# Altium schematic sheet WireTest.SchDoc
size D
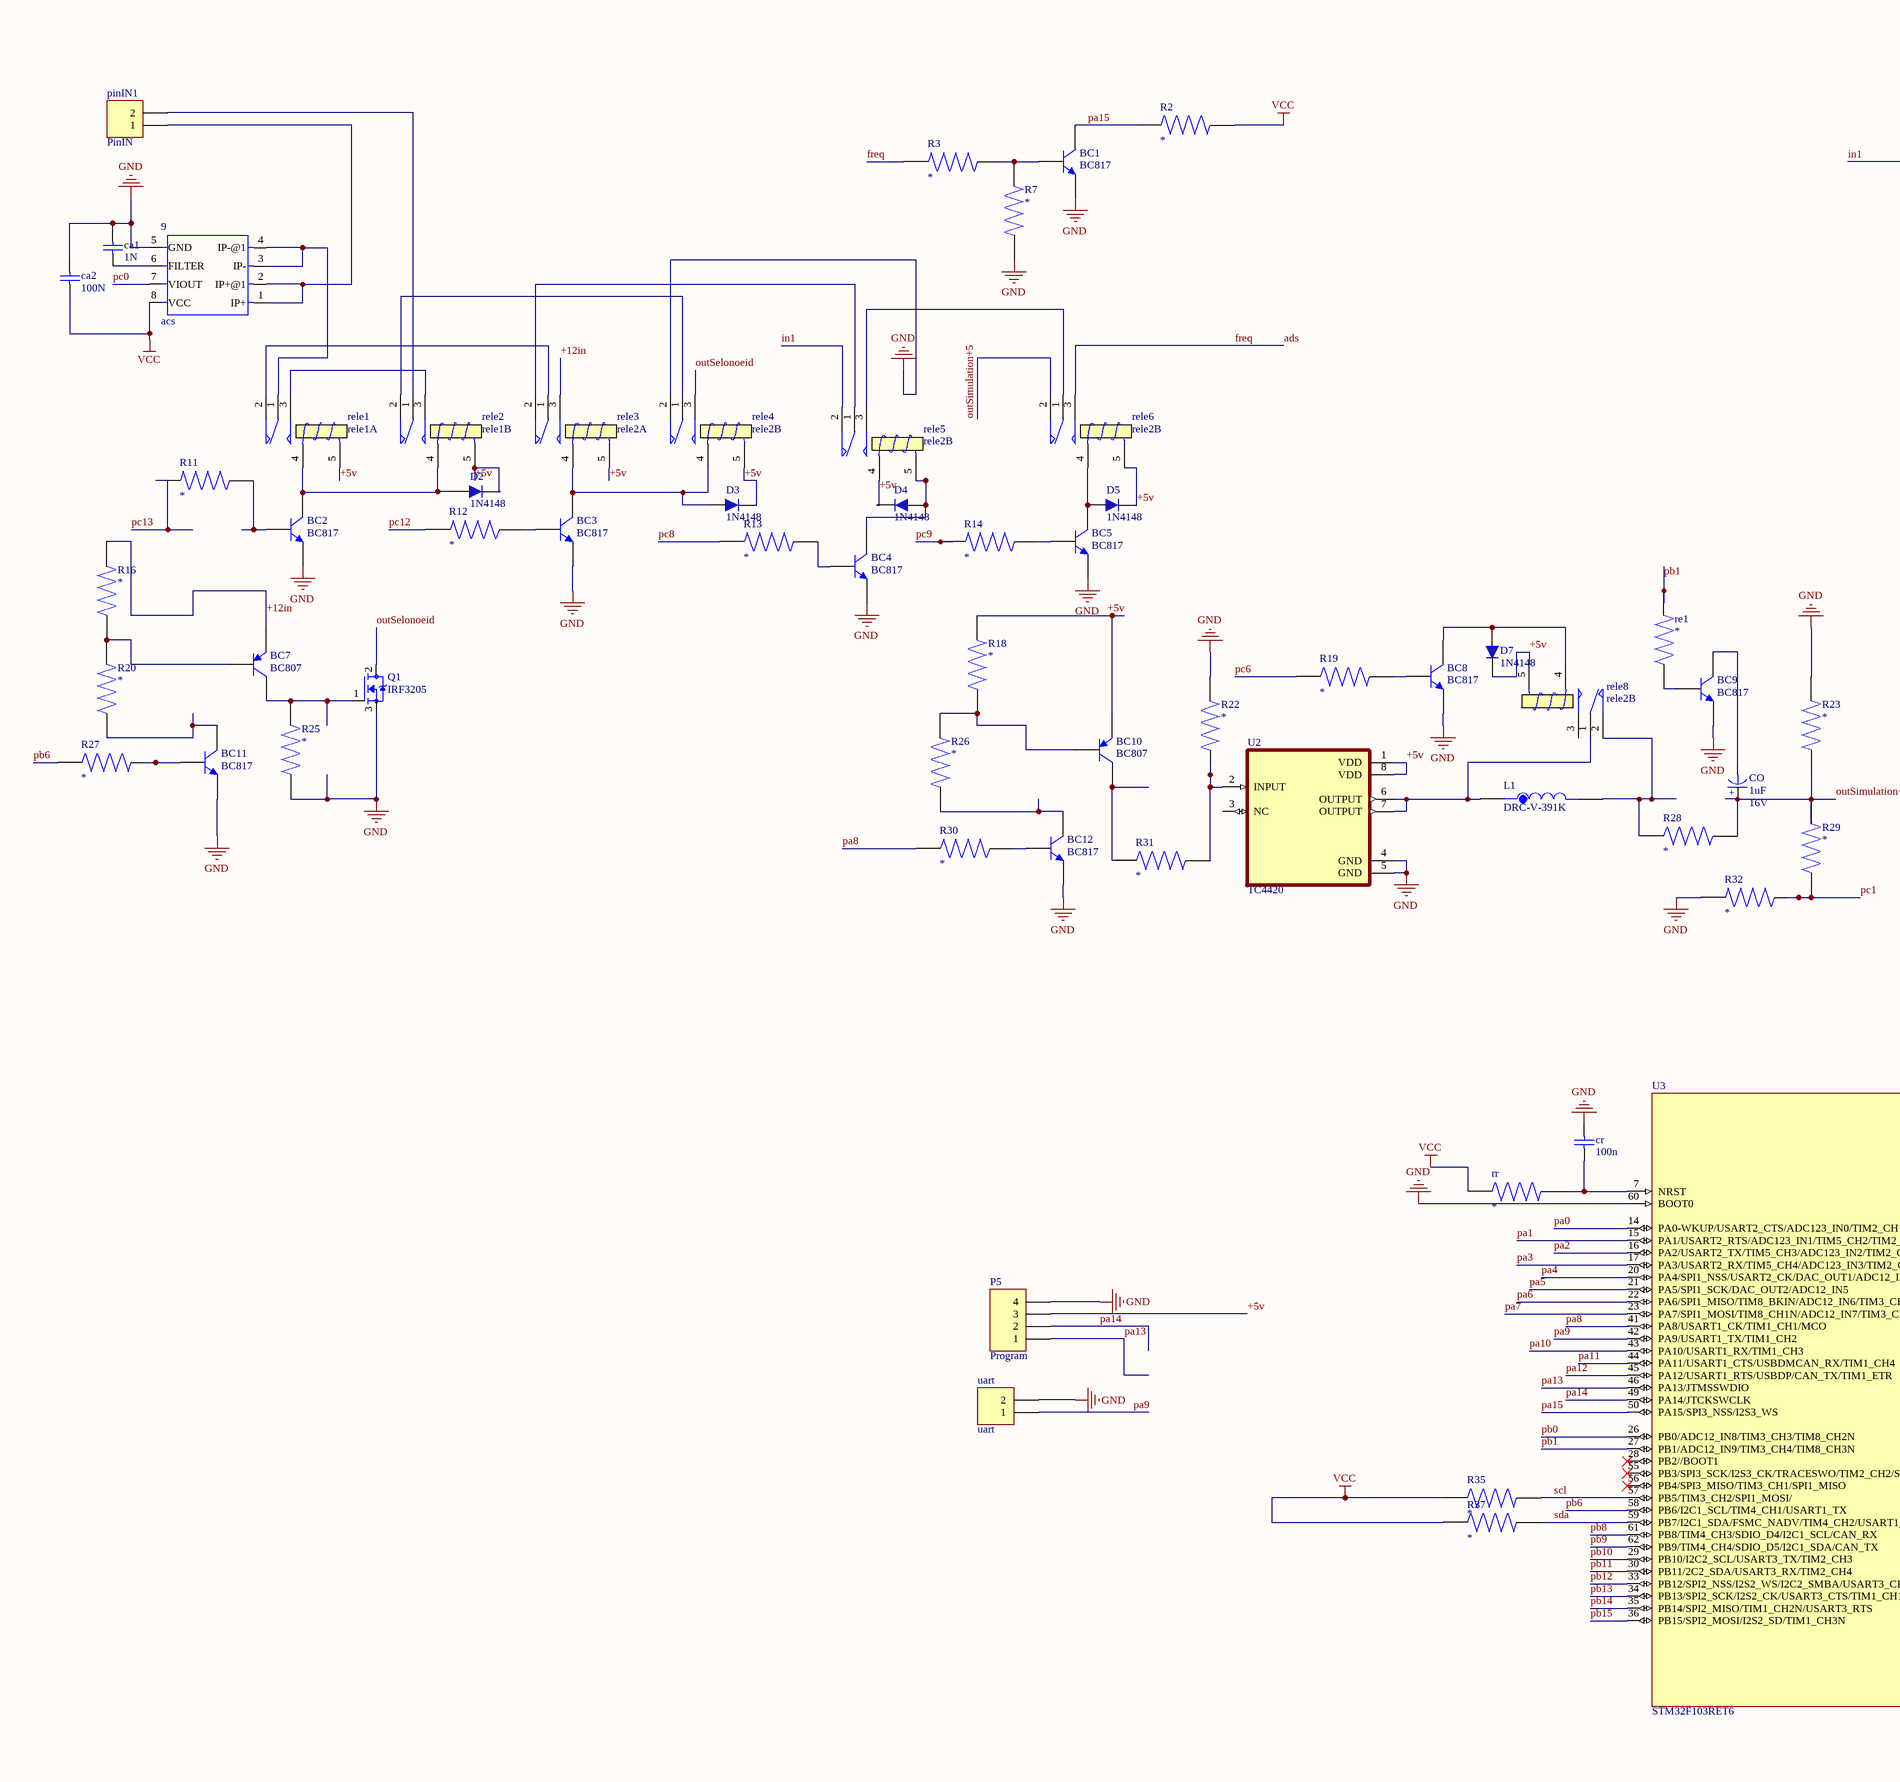
[diagram p0: WireTest.SchDoc, left]
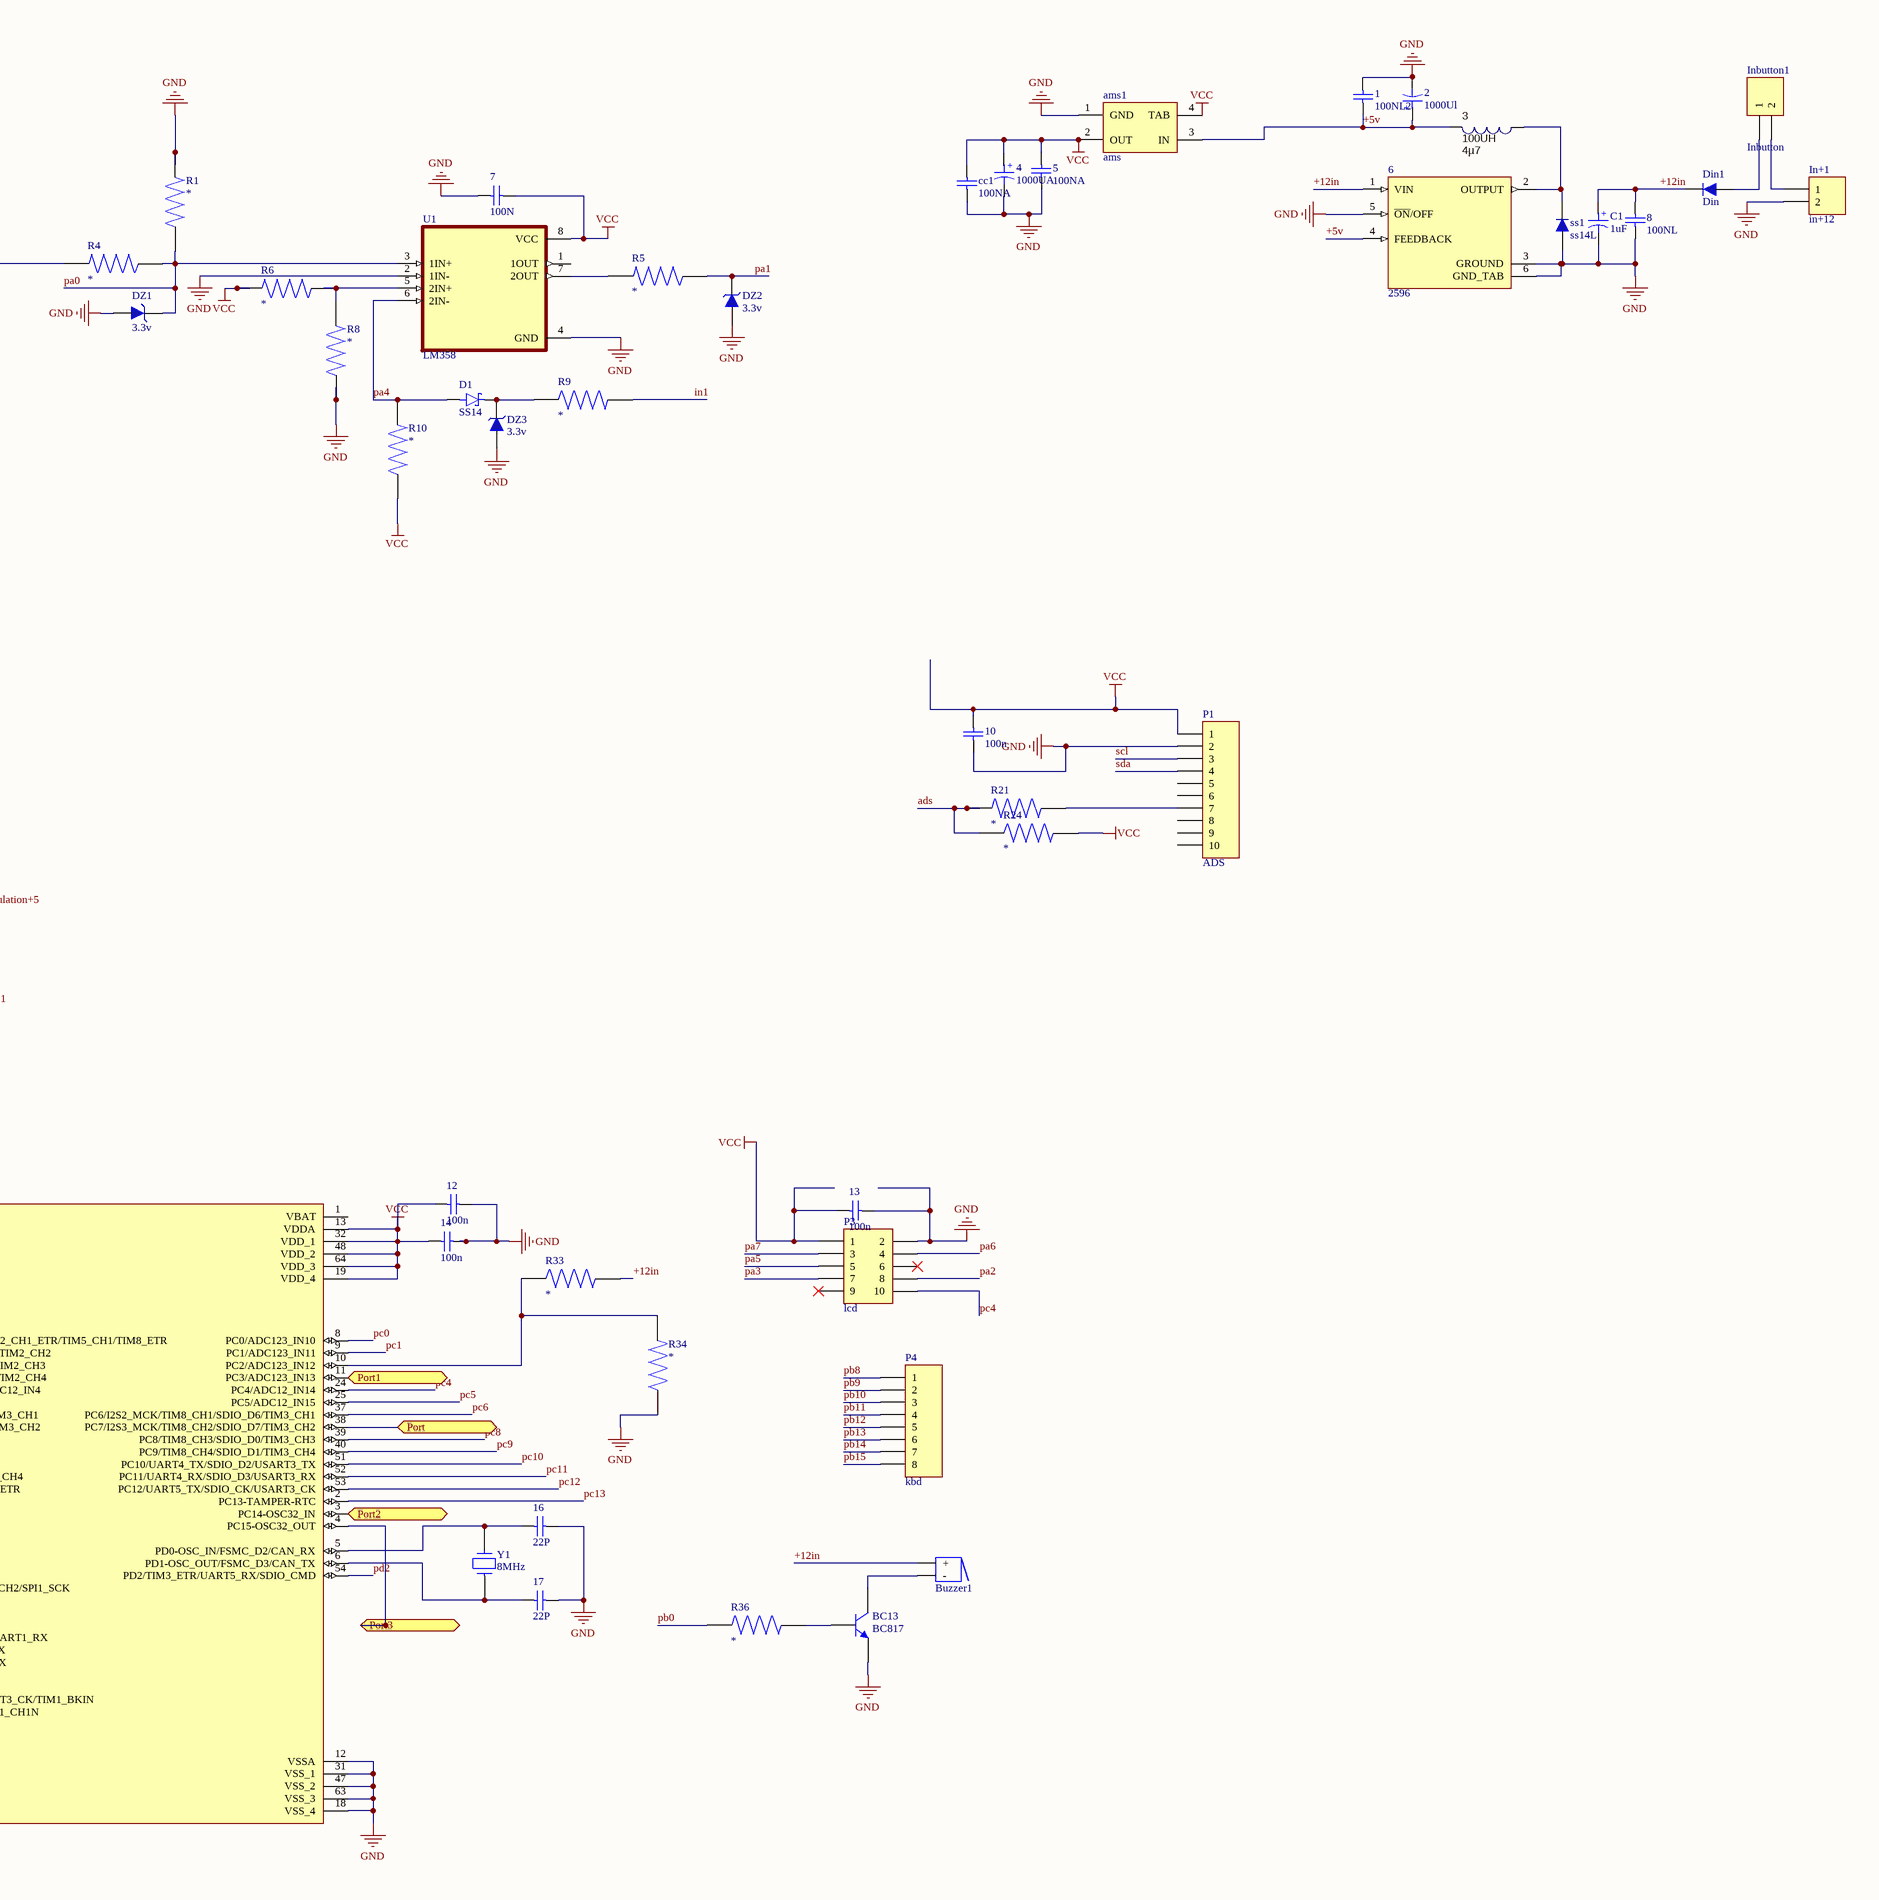
[diagram p1: WireTest.SchDoc, right]

## Parts
1  100NL2  [CAPC3413X12N]
2  1000Ul  [Cap electrolitic radial 8x12-3.5]
3  100UH  value 4µ7  [Inductor SMD 3x3.2mm]
4  1000UA  [Cap electrolitic radial 8x12-3.5]
5  100NA  [CAPC3413X12N]
6  2596  [TO170P1524X483-6N]
7  100N  [CAPC3413X12N]
8  100NL  [CAPC3413X12N]
9  acs  [SOIC8-1.27-5X4MM]
10  100n  [CAPC3413X12N]
12  100n  [CAPC3413X12N]
13  100n  [CAPC3413X12N]
14  100n  [CAPC3413X12N]
16  22P  [CAPC3413X12N]
17  22P  [CAPC3413X12N]
ams1  ams  [MP04A_N]
BC1  BC817  [SOT23_N]
BC2  BC817  [SOT23_N]
BC3  BC817  [SOT23_N]
BC4  BC817  [SOT23_N]
BC5  BC817  [SOT23_N]
BC7  BC807  [SOT23_BEC_N]
BC8  BC817  [SOT23_N]
BC9  BC817  [SOT23_N]
BC10  BC807  [SOT23_BEC_N]
BC11  BC817  [SOT23_N]
BC12  BC817  [SOT23_N]
BC13  BC817  [SOT23_N]
Buzzer1  Buzzer  [BUZZER]  (value not drawn)
C1  1uF  [Cap electrolitic radial 8x12-3.5]
ca1  1N  [CAPC3413X12N]
ca2  100N  [CAPC3413X12N]
cc1  100NA  [CAPC3413X12N]
CO  value 1uF  Voltage: 16V  [cap 01]  (hidden comment: 400U)
cr  100n  [CAPC3413X12N]
D1  SS14  [DIOM4325X250N]
D2  1N4148  [Diode 1n4148 SMD]
D3  1N4148  [Diode 1n4148 SMD]
D4  1N4148  [Diode 1n4148 SMD]
D5  1N4148  [Diode 1n4148 SMD]
D7  1N4148  [Diode 1n4148 SMD]
Din1  Din  [Diode 1W Stand]
DZ1  3.3v  [SOD80, LL-34]
DZ2  3.3v  [SOD80, LL-34]
DZ3  3.3v  [SOD80, LL-34]
In+1  in+12  [HDR1X2]
Inbutton1  Inbutton  [HDR1X2]
L1  DRC-V-391K  [IND_DRC-V-391K]
P1  ADS  [HDR1X10]
P3  lcd  [HDR2X5]
P4  kbd  [HDR1X8]
P5  Program  [HDR1X4]
pinIN1  PinIN  [HDR1X2]
Q1  IRF3205  [TO254P1067X483X3124-3P]
R1  4.7k  [RESC2012X65N]  (value not drawn)
R2  10k  [RESC2012X65N]  (value not drawn)
R3  4.7k  [RESC2012X65N]  (value not drawn)
R4  47k  [RESC2012X65N]  (value not drawn)
R5  1k  [RESC2012X65N]  (value not drawn)
R6  4.7k  [RESC2012X65N]  (value not drawn)
R7  10k  [RESC2012X65N]  (value not drawn)
R8  2.2k  [RESC2012X65N]  (value not drawn)
R9  4.7k  [RESC2012X65N]  (value not drawn)
R10  10k  [RESC2012X65N]  (value not drawn)
R11  1k  [RESC2012X65N]  (value not drawn)
R12  1k  [RESC2012X65N]  (value not drawn)
R13  1k  [RESC2012X65N]  (value not drawn)
R14  1k  [RESC2012X65N]  (value not drawn)
R16  10k  [RESC2012X65N]  (value not drawn)
R18  4.7k  [RESC2012X65N]  (value not drawn)
R19  1k  [RESC2012X65N]  (value not drawn)
R20  4.7k  [RESC2012X65N]  (value not drawn)
R21  10k  [RESC2012X65N]  (value not drawn)
R22  2.2k  [RESC2012X65N]  (value not drawn)
R23  adj  [RESC2012X65N]  (value not drawn)
R24  10k  [RESC2012X65N]  (value not drawn)
R25  10k  [RESC2012X65N]  (value not drawn)
R26  1k  [RESC2012X65N]  (value not drawn)
R27  4.7k  [RESC2012X65N]  (value not drawn)
R28  20r  [RESC2012X65N]  (value not drawn)
R29  10k  [RESC2012X65N]  (value not drawn)
R30  330r  [RESC2012X65N]  (value not drawn)
R31  20r  [RESC2012X65N]  (value not drawn)
R32  4.7k  [RESC2012X65N]  (value not drawn)
R33  10k  [RESC2012X65N]  (value not drawn)
R34  1k  [RESC2012X65N]  (value not drawn)
R35  4k7  [RESC2012X65N]  (value not drawn)
R36  1k  [RESC2012X65N]  (value not drawn)
R37  4k7  [RESC2012X65N]  (value not drawn)
re1  1k  [RESC2012X65N]  (value not drawn)
rele1  rele1A  [Relay 15.40x12.10x13.10]
rele2  rele1B  [Relay 15.40x12.10x13.10]
rele3  rele2A  [Relay 15.40x12.10x13.10]
rele4  rele2B  [Relay 15.40x12.10x13.10]
rele5  rele2B  [Relay 15.40x12.10x13.10]
rele6  rele2B  [Relay 15.40x12.10x13.10]
rele8  rele2B  [Relay 15.40x12.10x13.10]
rr  1k  [RESC2012X65N]  (value not drawn)
ss1  ss14L  [Diode 1N4007 SMD]
U1  LM358  [SOIC127P599X175-8N]
U2  TC4420  [DIP787W46P254L927H533Q8]
U3  STM32F103RET6  [QFP50P1200X1200X160-64N]
uart  uart  [HDR1X2]
Y1  8MHz  [My_Crystal]

## Ports
Port, Port1, Port2, Port3

## Nets
GND: 1.2 2.2 4.2 5.1 6.3(GROUND) 6.5(~{ON}/OFF) 6.6(GND_TAB) 7.2 8.1 9.5(GND) 10.2 12.2 13.2 14.2 16.1 17.1 ams1.1(GND) BC1.2(E) BC2.2(E) BC3.2(E) BC4.2(E) BC5.2(E) BC8.2(E) BC9.2(E) BC11.2(E) BC12.2(E) BC13.2(E) C1.2 ca1.1 ca2.1 cc1.1 cr.2 DZ1.1 DZ2.1 DZ3.1 In+1.2 P1.2 P3.2 P5.4 Q1.3(S) R1.1 R7.2 R8.2 R22.1 R23.2 R25.1 R32.2 R34.1 rele4.2(NC) ss1.1 U1.2(1IN-) U1.4(GND) U2.4(GND) U2.5(GND) U3.12(VSSA) U3.18(VSS_4) U3.31(VSS_1) U3.47(VSS_2) U3.60(BOOT0) U3.63(VSS_3) uart.2
VCC: 4.1 5.2 7.1 9.8(VCC) 10.1 12.1 13.1 14.1 ams1.2(OUT) ams1.4(TAB) ca2.2 cc1.2 P1.1 P3.1 R2.2 R6.2 R10.2 R24.2 R35.1 R37.1 rr.1 U1.8(VCC) U3.13(VDDA) U3.19(VDD_4) U3.32(VDD_1) U3.48(VDD_2) U3.64(VDD_3)
+5v: 1.1 2.1 3.2 6.4(FEEDBACK) ams1.3(IN) BC10.2(E) D2.2 D3.2 D4.2 D5.2 D7.2 P5.3 R18.1 rele1.5(T2) rele2.5(T2) rele3.5(T2) rele4.5(T2) rele5.4(T1) rele6.5(T2) rele8.5(T2) U2.1(VDD) U2.8(VDD)
+12in: 6.1(VIN) 8.2 BC7.2(E) Buzzer1.1(+) C1.1 Din1.2 R16.2 R33.2 rele3.3(NO)
ads: R3.2 R21.1 R24.1 rele6.3(NO)  [also labelled freq]
in1: R4.2 R9.2 rele5.2(NC)
outSelonoeid: Q1.2(D) rele4.3(NO)
outSimulation+5: CO.1(+) R23.1 R28.2 R29.2 rele6.2(NC)
pa0: DZ1.2 R1.2 R4.1 U1.3(1IN+) U3.14(PA0-WKUP/USART2_CTS/ADC123_IN0/TIM2_CH1_ETR/TIM5_CH1/TIM8_ETR)
pa1: DZ2.2 R5.1 U3.15(PA1/USART2_RTS/ADC123_IN1/TIM5_CH2/TIM2_CH2)
pa2: P3.8 U3.16(PA2/USART2_TX/TIM5_CH3/ADC123_IN2/TIM2_CH3)
pa3: P3.7 U3.17(PA3/USART2_RX/TIM5_CH4/ADC123_IN3/TIM2_CH4)
pa4: D1.A R10.1 U1.6(2IN-) U3.20(PA4/SPI1_NSS/USART2_CK/DAC_OUT1/ADC12_IN4)
pa5: P3.5 U3.21(PA5/SPI1_SCK/DAC_OUT2/ADC12_IN5)
pa6: P3.4 U3.22(PA6/SPI1_MISO/TIM8_BKIN/ADC12_IN6/TIM3_CH1)
pa7: P3.3 U3.23(PA7/SPI1_MOSI/TIM8_CH1N/ADC12_IN7/TIM3_CH2)
pa8: R30.2 U3.41(PA8/USART1_CK/TIM1_CH1/MCO)
pa9: U3.42(PA9/USART1_TX/TIM1_CH2) uart.1
pa10: U3.43(PA10/USART1_RX/TIM1_CH3)
pa11: U3.44(PA11/USART1_CTS/USBDMCAN_RX/TIM1_CH4)
pa12: U3.45(PA12/USART1_RTS/USBDP/CAN_TX/TIM1_ETR)
pa13: P5.1 U3.46(PA13/JTMSSWDIO)
pa14: P5.2 U3.49(PA14/JTCKSWCLK)
pa15: BC1.3(C) R2.1 U3.50(PA15/SPI3_NSS/I2S3_WS)
pb0: R36.1 U3.26(PB0/ADC12_IN8/TIM3_CH3/TIM8_CH2N)
pb1: re1.2 U3.27(PB1/ADC12_IN9/TIM3_CH4/TIM8_CH3N)
pb6: R27.1 U3.58(PB6/I2C1_SCL/TIM4_CH1/USART1_TX)
pb8: P4.1 U3.61(PB8/TIM4_CH3/SDIO_D4/I2C1_SCL/CAN_RX)
pb9: P4.2 U3.62(PB9/TIM4_CH4/SDIO_D5/I2C1_SDA/CAN_TX)
pb10: P4.3 U3.29(PB10/I2C2_SCL/USART3_TX/TIM2_CH3)
pb11: P4.4 U3.30(PB11/2C2_SDA/USART3_RX/TIM2_CH4)
pb12: P4.5 U3.33(PB12/SPI2_NSS/I2S2_WS/I2C2_SMBA/USART3_CK/TIM1_BKIN)
pb13: P4.6 U3.34(PB13/SPI2_SCK/I2S2_CK/USART3_CTS/TIM1_CH1N)
pb14: P4.7 U3.35(PB14/SPI2_MISO/TIM1_CH2N/USART3_RTS)
pb15: P4.8 U3.36(PB15/SPI2_MOSI/I2S2_SD/TIM1_CH3N)
pc0: 9.7(VIOUT) U3.8(PC0/ADC123_IN10)
pc1: R29.1 R32.1 U3.9(PC1/ADC123_IN11)
pc4: P3.10 U3.24(PC4/ADC12_IN14)
pc5: U3.25(PC5/ADC12_IN15)
pc6: R19.1 U3.37(PC6/I2S2_MCK/TIM8_CH1/SDIO_D6/TIM3_CH1)
pc8: R13.2 U3.39(PC8/TIM8_CH3/SDIO_D0/TIM3_CH3)
pc9: R14.2 U3.40(PC9/TIM8_CH4/SDIO_D1/TIM3_CH4)
pc10: U3.51(PC10/UART4_TX/SDIO_D2/USART3_TX)
pc11: U3.52(PC11/UART4_RX/SDIO_D3/USART3_RX)
pc12: R12.2 U3.53(PC12/UART5_TX/SDIO_CK/USART3_CK)
pc13: R11.2 U3.2(PC13-TAMPER-RTC)
pd2: U3.54(PD2/TIM3_ETR/UART5_RX/SDIO_CMD)
Port: U3.38(PC7/I2S3_MCK/TIM8_CH2/SDIO_D7/TIM3_CH2) ; port Port
Port1: U3.11(PC3/ADC123_IN13) ; port Port1
Port2: U3.3(PC14-OSC32_IN) ; port Port2
Port3: U3.4(PC15-OSC32_OUT) ; port Port3
scl: P1.3 R35.2 U3.57(PB5/TIM3_CH2/SPI1_MOSI/)
sda: P1.4 R37.2 U3.59(PB7/I2C1_SDA/FSMC_NADV/TIM4_CH2/USART1_RX)
Net3_1: 3.1 6.2(OUTPUT) ss1.2
Net9_1: 9.1(IP+) 9.2(IP+@1) pinIN1.1
Net9_3: 9.3(IP-) 9.4(IP-@1) rele1.1(COM)
Net9_6: 9.6(FILTER) ca1.2
Net16_2: 16.2 U3.5(PD0-OSC_IN/FSMC_D2/CAN_RX) Y1.2
Net17_2: 17.2 U3.6(PD1-OSC_OUT/FSMC_D3/CAN_TX) Y1.1
NetBC1_1: BC1.1(B) R3.1 R7.1
NetBC2_1: BC2.1(B) R11.1
NetBC2_3: BC2.3(C) D2.1 rele1.4(T1) rele2.4(T1)
NetBC3_1: BC3.1(B) R12.1
NetBC3_3: BC3.3(C) D3.1 rele3.4(T1) rele4.4(T1)
NetBC4_1: BC4.1(B) R13.1
NetBC4_3: BC4.3(C) D4.1 rele5.5(T2)
NetBC5_1: BC5.1(B) R14.1
NetBC5_3: BC5.3(C) D5.1 rele6.4(T1)
NetBC7_1: BC7.1(B) R16.1 R20.2
NetBC7_3: BC7.3(C) Q1.1(G) R25.2
NetBC8_1: BC8.1(B) R19.2
NetBC8_3: BC8.3(C) D7.1 rele8.4(T1)
NetBC9_1: BC9.1(B) re1.1
NetBC9_3: BC9.3(C) CO.2(-)
NetBC10_1: BC10.1(B) R18.2 R26.1
NetBC10_3: BC10.3(C) R31.1
NetBC11_1: BC11.1(B) R27.2
NetBC11_3: BC11.3(C) R20.1
NetBC12_1: BC12.1(B) R30.1
NetBC12_3: BC12.3(C) R26.2
NetBC13_1: BC13.1(B) R36.2
NetBC13_3: BC13.3(C) Buzzer1.2(-)
Netcr_1: cr.1 rr.2 U3.7(NRST)
NetD1_C: D1.C(K) DZ3.2 R9.1
NetDin1_1: Din1.1 Inbutton1.1
NetIn+1_1: In+1.1 Inbutton1.2
NetL1_1: L1.1 rele8.1(COM) U2.6(OUTPUT) U2.7(OUTPUT)
NetL1_2: L1.2 R28.1 rele8.2(NC)
NetP1_7: P1.7 R21.2
NetpinIN1_2: pinIN1.2 rele2.1(COM)
NetR5_2: R5.2 U1.7(2OUT)
NetR6_1: R6.1 R8.1 U1.5(2IN+)
NetR22_2: R22.2 R31.2 U2.2(INPUT)
NetR33_1: R33.1 R34.2 U3.10(PC2/ADC123_IN12)
Netrele1_2: rele1.2(NC) rele3.1(COM)
Netrele1_3: rele1.3(NO) rele2.3(NO)
Netrele2_2: rele2.2(NC) rele4.1(COM)
Netrele3_2: rele3.2(NC) rele5.1(COM)
Netrele5_3: rele5.3(NO) rele6.1(COM)

Not connected (* = marked no-connect by the designer): P1 5 6 8 9 10; P3 6* 9*; rele8 3(NO); U1 1(1OUT); U2 3(NC); U3 1(VBAT) 28(PB2//BOOT1)* 55(PB3/SPI3_SCK/I2S3_CK/TRACESWO/TIM2_CH2/SPI1_SCK)* 56(PB4/SPI3_MISO/TIM3_CH1/SPI1_MISO)*

## Notes on the sheet
- (in symbol Cap ELECTROLITIC TOTAL SIZE) +

## Library data of the parts
1 5 7 8 10 12-14 16 17 ca1 ca2 cc1 cr = CAP SMD 0805: CAP 0805; Designer: Abbas Basereh; Desc.: CAP SMD 0805; Data: 16-12-2016
2 4 = Cap ELECTROLITIC TOTAL SIZE: Cap electrolitic radial; Designer: Abbas Basereh; VALUE: 1uF; Data: 16-12-2016; Part. No: *
3 = Inductor 4.7µH SMD 3x3.2mm: Tolerance: ±20%; SCDType: source; Package / Case: Inductor 4.7µH SMD 3x3.2mm; Type: Ferrite Core; Supplier 1: Digi-Key; Operating Temperature: -40°C ~ 125°C
6 = LM2596S-5.0: Value: *; MP: LM2596S-5.0; Package: None; Availability: Unavailable; Price: None
9 = CURRENT-ACS712ELCTR-05B-T(SOIC8-5X4MM): Current Sensor 5A 1 Channel Hall Effect, Open Loop Bidirectional 8-SOIC _0.154, 3.90mm Width_; MF: Allegro; Value: *; SnapEDA_Link: https://www.snapeda.com/parts/ACS712ELCTR-05B-T/Allegro%20Industries/view-part/217679/?ref=snap; Availability: Unavailable; MP: ACS712ELCTR-05B-T; Package: SOIC-8 Allegro MicroSystems LLC; Price: None
ams1 = LM1117IMP-x.x: x.x Volt, 800mA Low-Dropout Linear Regulator, 4-pin SOT-223; PartNumber: LM1117IMP-3.3; Manufacturer: National Semiconductor; PackageTopMarking: XYTT*N05B; PowerWise: N; CompType: LDO IC; Published: 4-Dec-2008; DatasheetVersion: Apr-2006; PackageVersion: revB, Apr-2003; PackageReference: MP04A; Publisher: Altium Limited; PackageDescription: Molded SOT-223, 6.50 x 3.56 x 1.6mm Body, 4 Lead, 2.3mm Pitch; Supplier 1: Farnell; Supplier Part Number 1: 7614123; RoHS: N; PinCount: 4; Code_JEDEC: TO-261-AA; Code_IPC: SOT223-4; ComponentLink1Description: LM1117 Datasheet; ComponentLink1URL: http://www.national.com/ds/LM/LM1117.pdf; ComponentLink2Description: LM1117 Web Page; ComponentLink2URL: http://www.national.com/pf/LM/LM1117.html; ComponentLink3Description: MP04A Package Page; ComponentLink3URL: http://www.national.com/packaging/folders/mp04a.html
BC1-BC5 BC8 BC9 BC11-BC13 = BC817: 45 V, 500 mA NPN general-purpose transistors; Published: 2017-2-8; LatestRevisionDate: 2017; LatestRevisionNote: IPC-7351 Footprint Added.; DatasheetVersion: 2017; PackageVersion: 2017-2-8; PackageReference: SOT23; Publisher: Abbas Basereh; PackageDescription: 3-Pin SOT-23 Package 0.95 mm Pitch, 2.3 mm Lead Span; ComponentLink1Description: Manufacturer Link; ComponentLink1URL: http://www.nxp.com/; ComponentLink2Description: Datasheet; ComponentLink2URL: http://www.nxp.com/
BC7 BC10 = BC807: PNP General-purpose Transistor; Published: 8-Jun-2000; LatestRevisionDate: 29-May-2009; LatestRevisionNote: IPC-7351 Footprint Added.; PackageVersion: Aug-1999; PackageReference: SOT-23B; Publisher: Altium Limited; PackageDescription: 3-Pin SOT-23 Package 0.95 mm Pitch, 2.4 mm Lead Span
Buzzer1 = Buzzer: Designer: Seyed Mohsen Ghasemain; ComponentLinkURL: www.picpars.com
C1 = Cap ELECTROLITIC TOTAL SIZE: Cap electrolitic radial; Designer: Abbas Basereh; Data: 16-12-2016; Part. No: *; VALUE: 1uF
CO = Cap-Polar: Polar Capacitor; Designer: Saeid Jorablo; Organazation: ControTec; Adding Date: 1387/12/20
D2-D5 D7 = 1N4148 SMD: General Semicoductor
Din1 ss1 = Diode DIP Package: Published: 8-Jun-2000; LatestRevisionDate: 17-Jul-2002; LatestRevisionNote: Re-released for DXP Platform.; DatasheetVersion: 1997; Publisher: Altium Limited; PackageDescription: Diode, Axial; Body 3.8 x 1.9 mm (LxDia. max), Lead Dia. 0.53 mm (max); Code_JEDEC: DO-204-AH; ComponentLink1Description: Manufacturer Link; ComponentLink1URL: http://www.fairchildsemi.com/; ComponentLink2Description: Datasheet; ComponentLink2URL: http://www.fairchildsemi.com/ds/1N%2F1N4148.pdf
DZ1-DZ3 = ZENER GENERAL DIODE: DIODE ZENER GENERAL; VALUE: 12V; Published: 2017-1-12; PackageVersion: 2017-1-12; PackageReference: DO 35; Publisher: Abbas Basereh; PackageDescription: DIODE GEN ZENER; ComponentLink1Description: Manufacturer Link; ComponentLink2Description: Datasheet
In+1 Inbutton1 pinIN1 uart = Header 2: Header, 2-Pin; LatestRevisionDate: 17-Jul-2002; LatestRevisionNote: Re-released for DXP Platform.; Publisher: Altium Limited
L1 = DRC-V-391K: Radial Coil Inductor; MF: Bel Fuse; Price: None; SnapEDA_Link: https://www.snapeda.com/parts/DRC-V-391K/Bel+Fuse/view-part/?ref=snap; Purchase-URL: https://pricing.snapeda.com/search/part/DRC-V-391K/?ref=eda; Check_prices: https://www.snapeda.com/parts/DRC-V-391K/Bel+Fuse/view-part/?ref=eda; MP: DRC-V-391K; Value: *; Availability: In Stock; Package: None
P1 = Header 10: Header, 10-Pin; LatestRevisionDate: 17-Jul-2002; LatestRevisionNote: Re-released for DXP Platform.; Publisher: Altium Limited
P3 = Header 5X2: Header, 5-Pin, Dual row; LatestRevisionDate: 17-Jul-2002; LatestRevisionNote: Re-released for DXP Platform.; Publisher: Altium Limited
P4 = Header 8: Header, 8-Pin; LatestRevisionDate: 17-Jul-2002; LatestRevisionNote: Re-released for DXP Platform.; Publisher: Altium Limited
P5 = Header 4: Header, 4-Pin; LatestRevisionDate: 17-Jul-2002; LatestRevisionNote: Re-released for DXP Platform.; Publisher: Altium Limited
Q1 = IRF3205PBF: N-Channel 55V 110A _Tc_ 200W _Tc_ Through Hole TO-220AB; MF: Infineon Technologies; Package: TO-220 International Rectifier; MP: IRF3205PBF; Value: *; Availability: Unavailable; Price: None; SnapEDA_Link: https://www.snapeda.com/parts/IRF3205PBF/Infineon%20Technologies/view-part/98571/?ref=snap
R1-R14 R16 R18-R37 re1 rr = CRGCQ0805F10K: 10 kOhms Â±1% 0.125W, 1/8W Chip Resistor 0805 (2012 Metric) Automotive AEC-Q200, Moisture Resistant Thick Film; MF: TE Connectivity; SnapEDA_Link: https://www.snapeda.com/parts/CRGCQ0805F10K/TE+Connectivity/view-part/?ref=snap; Package: 2012 TE Connectivity; MP: CRGCQ0805F10K; Check_prices: https://www.snapeda.com/parts/CRGCQ0805F10K/TE+Connectivity/view-part/?ref=eda; Comment_1: *
  R1-R3 R5-R14 R16 R18-R37 re1 rr: Value: *
  R4: Value: 47k
rele1-rele6 rele8 = RELAY General: Relay_SPDT POWER NEEDLE; Designer: Ali Hafizi; Company: E.P.I.L; Design_Date: 2011/10/31
U1 = LM358DRG3: Dual, 30-V, 700-kHz operational amplifier; MF: Texas Instruments; SnapEDA_Link: https://www.snapeda.com/parts/LM358DRG3/Texas+Instruments/view-part/?ref=snap; Package: SOIC-8 Texas Instruments; Value: *; MP: LM358DRG3; Check_prices: https://www.snapeda.com/parts/LM358DRG3/Texas+Instruments/view-part/?ref=eda
U2 = TC4420CPA: Microchip MOSFET Power Driver 6A 4.5 to 18V Non-Inverting 8-Pin PDIP | Microchip Technology Inc. TC4420CPA; SnapEDA_Link: https://www.snapeda.com/parts/TC4420CPA/Microchip/view-part/?ref=snap; Package: DIP-8 Microchip; Value: *; MF: Microchip; MP: TC4420CPA; Check_prices: https://www.snapeda.com/parts/TC4420CPA/Microchip/view-part/?ref=eda
U3 = STM32F103RET6: ARMÂ® CortexÂ®-M3 STM32F1 Microcontroller IC 32-Bit 72MHz 512KB (512K x 8) FLASH 64-LQFP (10x10); MF: STMicroelectronics; SnapEDA_Link: https://www.snapeda.com/parts/STM32F103RET6/STMicroelectronics/view-part/?ref=snap; Package: LQFP-64 STMicroelectronics; Value: *; MP: STM32F103RET6; Check_prices: https://www.snapeda.com/parts/STM32F103RET6/STMicroelectronics/view-part/?ref=eda
Y1 = CRYSTAL
D1 = SS14: Value: *; Availability: Unavailable; Price: None; Package: None; MP: SS14